# Altium schematic sheet Sheet1.SchDoc
size A4
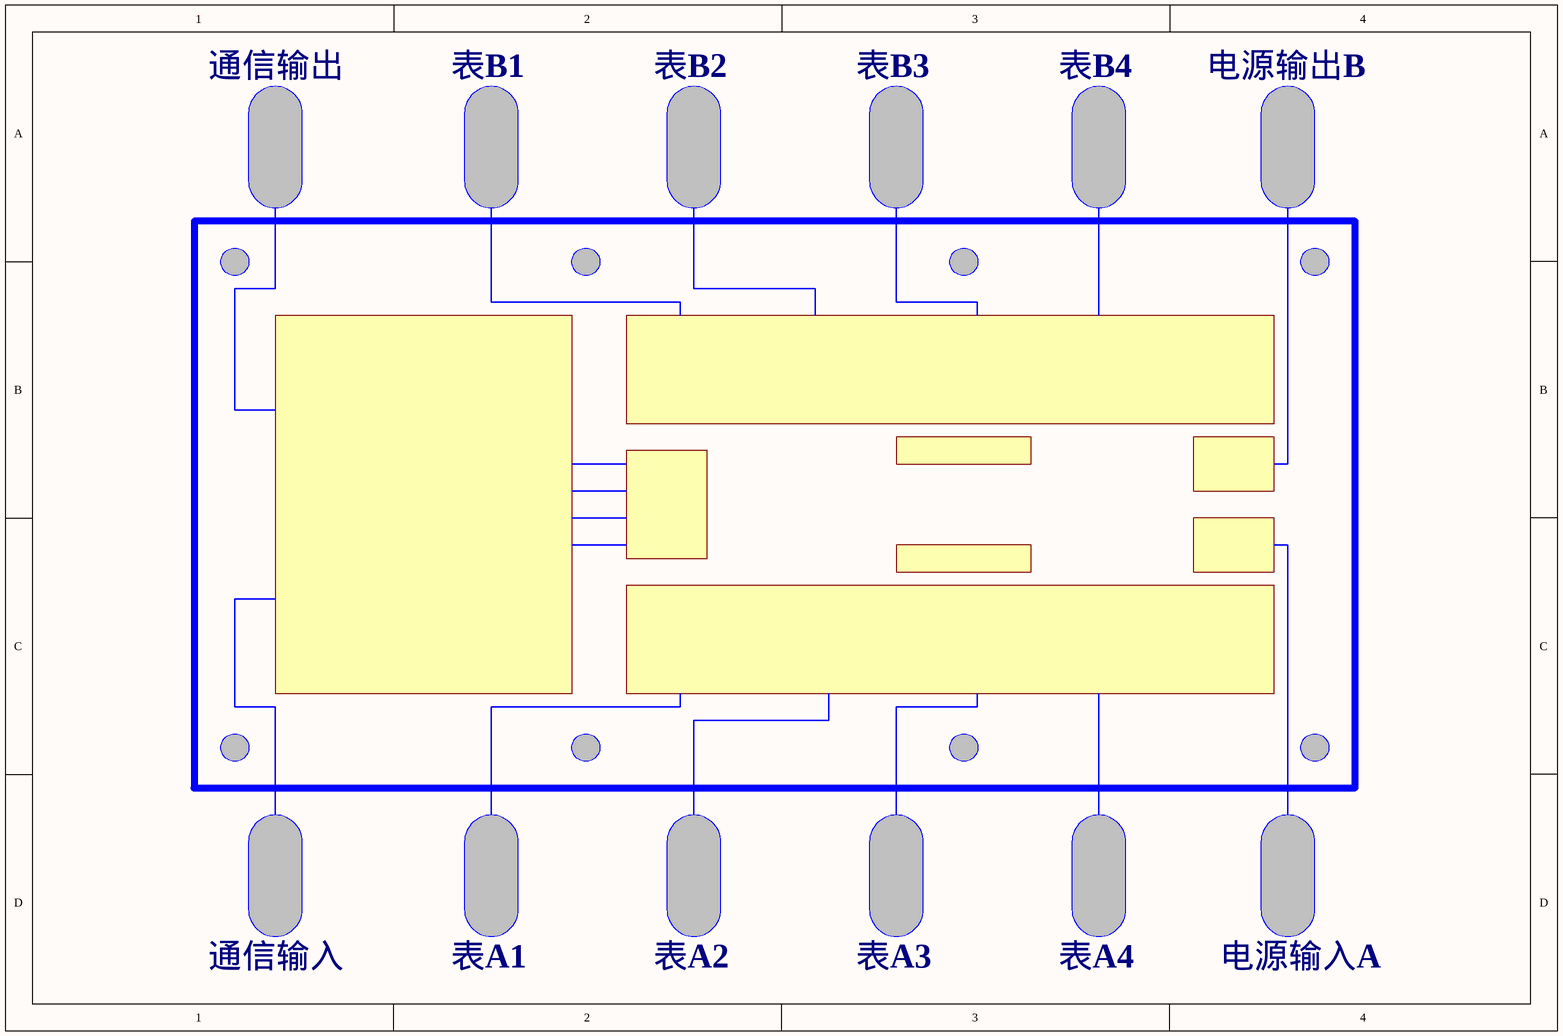
[diagram p0: Sheet1.SchDoc]

## Notes on the sheet
- 通信输出
- 表B1
- 表B2
- 表B3
- 表B4
- 电源输出B
- 通信输入
- 表A1
- 表A2
- 表A3
- 表A4
- 电源输入A